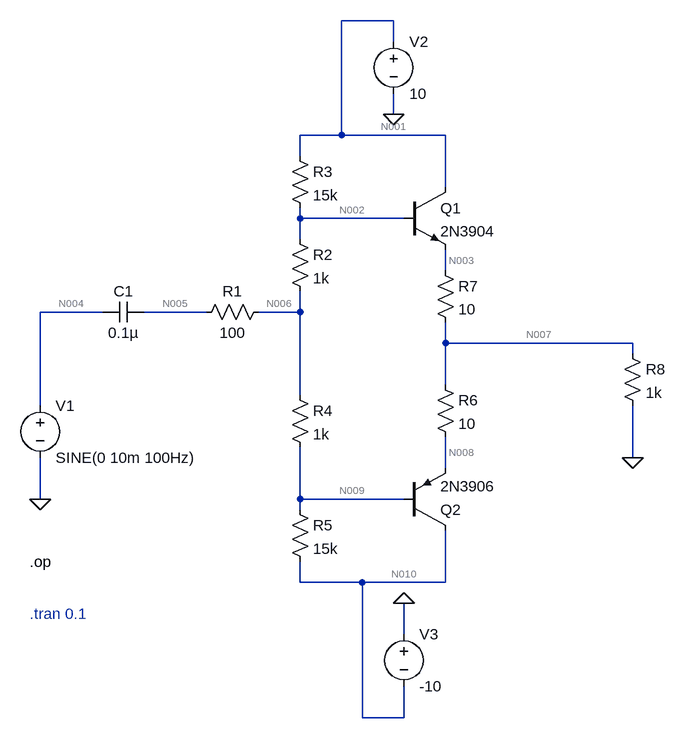
[diagram p0: schematic Darlington Pair Amplifier.asc]
Darlington Pair Amplifier.asc, the LTspice schematic file:
Version 4.1
SHEET 1 1144 680
WIRE 720 -448 640 -448
WIRE 720 -416 720 -448
WIRE 720 -304 720 -336
WIRE 640 -272 640 -448
WIRE 640 -272 576 -272
WIRE 800 -272 640 -272
WIRE 576 -240 576 -272
WIRE 800 -192 800 -272
WIRE 576 -144 576 -160
WIRE 736 -144 576 -144
WIRE 576 -112 576 -144
WIRE 800 -64 800 -96
WIRE 272 0 176 0
WIRE 432 0 336 0
WIRE 576 0 576 -32
WIRE 576 0 512 0
WIRE 800 48 800 16
WIRE 1088 48 800 48
WIRE 1088 64 1088 48
WIRE 800 112 800 48
WIRE 576 128 576 0
WIRE 176 144 176 0
WIRE 1088 224 1088 144
WIRE 800 240 800 192
WIRE 176 288 176 224
WIRE 576 288 576 208
WIRE 736 288 576 288
WIRE 576 304 576 288
WIRE 576 416 576 384
WIRE 672 416 576 416
WIRE 800 416 800 336
WIRE 800 416 672 416
WIRE 736 496 736 448
WIRE 672 624 672 416
WIRE 736 624 736 576
WIRE 736 624 672 624
FLAG 1088 224 0
FLAG 176 288 0
FLAG 720 -304 0
FLAG 736 448 0
SYMBOL voltage 176 128 R0
WINDOW 123 0 0 Left 0
WINDOW 39 0 0 Left 0
SYMATTR InstName V1
SYMATTR Value SINE(0 10m 100Hz)
SYMBOL cap 336 -16 R90
WINDOW 0 0 32 VBottom 2
WINDOW 3 32 32 VTop 2
SYMATTR InstName C1
SYMATTR Value 0.1µ
SYMBOL res 528 -16 R90
WINDOW 0 0 56 VBottom 2
WINDOW 3 32 56 VTop 2
SYMATTR InstName R1
SYMATTR Value 100
SYMBOL res 560 -128 R0
SYMATTR InstName R2
SYMATTR Value 1k
SYMBOL res 560 -256 R0
SYMATTR InstName R3
SYMATTR Value 15k
SYMBOL res 560 112 R0
SYMATTR InstName R4
SYMATTR Value 1k
SYMBOL res 560 288 R0
SYMATTR InstName R5
SYMATTR Value 15k
SYMBOL res 784 96 R0
SYMATTR InstName R6
SYMATTR Value 10
SYMBOL res 784 -80 R0
SYMATTR InstName R7
SYMATTR Value 10
SYMBOL res 1072 48 R0
SYMATTR InstName R8
SYMATTR Value 1k
SYMBOL npn 736 -192 R0
SYMATTR InstName Q1
SYMATTR Value 2N3904
SYMBOL voltage 720 -432 R0
WINDOW 123 0 0 Left 0
WINDOW 39 0 0 Left 0
SYMATTR InstName V2
SYMATTR Value 10
SYMBOL voltage 736 480 R0
WINDOW 123 0 0 Left 0
WINDOW 39 0 0 Left 0
SYMATTR InstName V3
SYMATTR Value -10
SYMBOL pnp 736 336 M180
SYMATTR InstName Q2
SYMATTR Value 2N3906
TEXT 160 384 Left 2 !.op
TEXT 160 464 Left 2 ;.tran 0.1

The netlist it stands for:
* Darlington Pair Amplifier.asc
V1 N004 0 SINE(0 10m 100Hz)
C1 N005 N004 0.1µ
R1 N006 N005 100
R2 N002 N006 1k
R3 N001 N002 15k
R4 N006 N009 1k
R5 N009 N010 15k
R6 N007 N008 10
R7 N003 N007 10
R8 N007 0 1k
Q1 N001 N002 N003 0 2N3904
V2 N001 0 10
V3 0 N010 -10
Q2 N010 N009 N008 0 2N3906
.model NPN NPN
.model PNP PNP
.lib standard.bjt
.op
* .tran 0.1
.backanno
.end

* Results of the author's LTspice run, read from the files saved beside the schematic
* Operating Point:
*   V(n001) = 10 V
*   V(n002) = 9.758 V
*   V(n003) = 9.045 V
*   V(n004) = 0 V
*   V(n005) = 9.772 V
*   V(n006) = 9.772 V
*   V(n007) = 8.955 V
*   V(n008) = 8.955 V
*   V(n009) = 9.787 V
*   V(n010) = 10 V
*   I(C1) = 0 A
*   I(R1) = 0 A
*   I(R2) = -14.22 µA
*   I(R3) = 16.12 µA
*   I(R4) = -14.22 µA
*   I(R5) = -14.22 µA
*   I(R6) = -38.9 pA
*   I(R7) = 8.955 mA
*   I(R8) = 8.955 mA
*   I(V1) = 0 A
*   I(V2) = -8.941 mA
*   I(V3) = 14.22 µA
*   Ib(Q1) = 30.34 µA
*   Ib(Q2) = -8.921 pA
*   Ic(Q1) = 8.925 mA
*   Ic(Q2) = 47.84 pA
*   Ie(Q1) = -8.955 mA
*   Ie(Q2) = -38.9 pA
*   Is(Q1) = 0 A
*   Is(Q2) = 0 A